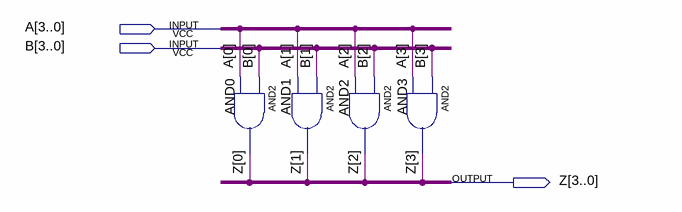
[diagram p0: schematic sheet]
// Quartus schematic AND30.bdf as structural Verilog: 4 symbols, 3 pins
module AND30 (
  input  [3:0] A,
  input  [3:0] B,
  output [3:0] Z
);

  and AND0 (Z[0], B[0], A[0]);
  and AND1 (Z[1], B[1], A[1]);
  and AND2 (Z[2], B[2], A[2]);
  and AND3 (Z[3], B[3], A[3]);
endmodule
